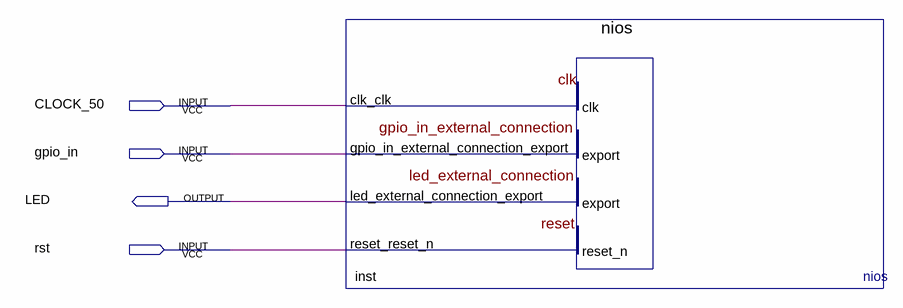
[diagram p0: schematic sheet]
// Quartus schematic FPGA2.bdf as structural Verilog: 1 symbols, 4 pins
module FPGA2 (
  input  CLOCK_50,
  input  gpio_in,
  input  rst,
  output LED
);

  nios inst (
    .clk_clk(CLOCK_50), .gpio_in_external_connection_export(gpio_in), .reset_reset_n(rst),
    .led_external_connection_export(LED));
endmodule
